# EAGLE design LED tail lights (EAGLE 4.13)
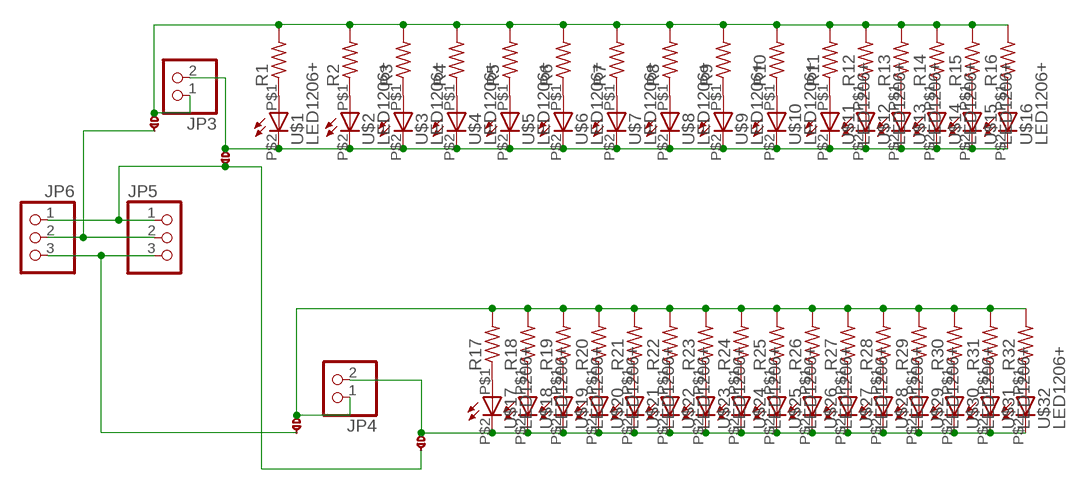
[diagram p0: schematic, sheet 1]

## Parts
JP3  PINHD-1X2  [1X02]
JP4  PINHD-1X2  [1X02]
JP5  PINHD-1X3  [1X03]
JP6  PINHD-1X3  [1X03]
R1  RESISITORR1206  [R1206]
R2  RESISITORR1206  [R1206]
R3  RESISITORR1206  [R1206]
R4  RESISITORR1206  [R1206]
R5  RESISITORR1206  [R1206]
R6  RESISITORR1206  [R1206]
R7  RESISITORR1206  [R1206]
R8  RESISITORR1206  [R1206]
R9  RESISITORR1206  [R1206]
R10  RESISITORR1206  [R1206]
R11  RESISITORR1206  [R1206]
R12  RESISITORR1206  [R1206]
R13  RESISITORR1206  [R1206]
R14  RESISITORR1206  [R1206]
R15  RESISITORR1206  [R1206]
R16  RESISITORR1206  [R1206]
R17  RESISITORR1206  [R1206]
R18  RESISITORR1206  [R1206]
R19  RESISITORR1206  [R1206]
R20  RESISITORR1206  [R1206]
R21  RESISITORR1206  [R1206]
R22  RESISITORR1206  [R1206]
R23  RESISITORR1206  [R1206]
R24  RESISITORR1206  [R1206]
R25  RESISITORR1206  [R1206]
R26  RESISITORR1206  [R1206]
R27  RESISITORR1206  [R1206]
R28  RESISITORR1206  [R1206]
R29  RESISITORR1206  [R1206]
R30  RESISITORR1206  [R1206]
R31  RESISITORR1206  [R1206]
R32  RESISITORR1206  [R1206]
U$1  LED1206+  [1206+]
U$2  LED1206+  [1206+]
U$3  LED1206+  [1206+]
U$4  LED1206+  [1206+]
U$5  LED1206+  [1206+]
U$6  LED1206+  [1206+]
U$7  LED1206+  [1206+]
U$8  LED1206+  [1206+]
U$9  LED1206+  [1206+]
U$10  LED1206+  [1206+]
U$11  LED1206+  [1206+]
U$12  LED1206+  [1206+]
U$13  LED1206+  [1206+]
U$14  LED1206+  [1206+]
U$15  LED1206+  [1206+]
U$16  LED1206+  [1206+]
U$17  LED1206+  [1206+]
U$18  LED1206+  [1206+]
U$19  LED1206+  [1206+]
U$20  LED1206+  [1206+]
U$21  LED1206+  [1206+]
U$22  LED1206+  [1206+]
U$23  LED1206+  [1206+]
U$24  LED1206+  [1206+]
U$25  LED1206+  [1206+]
U$26  LED1206+  [1206+]
U$27  LED1206+  [1206+]
U$28  LED1206+  [1206+]
U$29  LED1206+  [1206+]
U$30  LED1206+  [1206+]
U$31  LED1206+  [1206+]
U$32  LED1206+  [1206+]
U$34  SPLIT_PAD  [SPLIT_PAD]
U$35  SPLIT_PAD  [SPLIT_PAD]
U$36  SPLIT_PAD  [SPLIT_PAD]
U$37  SPLIT_PAD  [SPLIT_PAD]

## Nets
N$1: R1.1 U$1.P$1(+)
N$2: R2.1 U$2.P$1(+)
N$3: R3.1 U$3.P$1(+)
N$4: R4.1 U$4.P$1(+)
N$5: R5.1 U$5.P$1(+)
N$6: R6.1 U$6.P$1(+)
N$7: R7.1 U$7.P$1(+)
N$8: R8.1 U$8.P$1(+)
N$9: R9.1 U$9.P$1(+)
N$10: R10.1 U$10.P$1(+)
N$13: R11.1 U$11.P$1(+)
N$16: R12.1 U$12.P$1(+)
N$17: R13.1 U$13.P$1(+)
N$18: R14.1 U$14.P$1(+)
N$19: R15.1 U$15.P$1(+)
N$20: R16.1 U$16.P$1(+)
N$21: R32.1 U$32.P$1(+)
N$22: R31.1 U$31.P$1(+)
N$23: R30.1 U$30.P$1(+)
N$24: R29.1 U$29.P$1(+)
N$25: R28.1 U$28.P$1(+)
N$26: R27.1 U$27.P$1(+)
N$27: R26.1 U$26.P$1(+)
N$28: R25.1 U$25.P$1(+)
N$29: R24.1 U$24.P$1(+)
N$30: R23.1 U$23.P$1(+)
N$31: R22.1 U$22.P$1(+)
N$32: R21.1 U$21.P$1(+)
N$33: R20.1 U$20.P$1(+)
N$34: R19.1 U$19.P$1(+)
N$35: R18.1 U$18.P$1(+)
N$36: R17.1 U$17.P$1(+)
N$38: JP4.1 R17.2 R18.2 R19.2 R20.2 R21.2 R22.2 R23.2 R24.2 R25.2 R26.2 R27.2 R28.2 R29.2 R30.2 R31.2 R32.2 U$37.P$1
N$39: JP3.1 R1.2 R2.2 R3.2 R4.2 R5.2 R6.2 R7.2 R8.2 R9.2 R10.2 R11.2 R12.2 R13.2 R14.2 R15.2 R16.2 U$34.P$1
N$43: JP4.2 U$17.P$2(-) U$18.P$2(-) U$19.P$2(-) U$20.P$2(-) U$21.P$2(-) U$22.P$2(-) U$23.P$2(-) U$24.P$2(-) U$25.P$2(-) U$26.P$2(-) U$27.P$2(-) U$28.P$2(-) U$29.P$2(-) U$30.P$2(-) U$31.P$2(-) U$32.P$2(-) U$36.P$1
N$45: JP5.1 JP6.1 U$35.P$2 U$36.P$2
N$46: JP5.2 JP6.2 U$34.P$2
N$47: JP5.3 JP6.3 U$37.P$2
N$48: JP3.2 U$1.P$2(-) U$2.P$2(-) U$3.P$2(-) U$4.P$2(-) U$5.P$2(-) U$6.P$2(-) U$7.P$2(-) U$8.P$2(-) U$9.P$2(-) U$10.P$2(-) U$11.P$2(-) U$12.P$2(-) U$13.P$2(-) U$14.P$2(-) U$15.P$2(-) U$16.P$2(-) U$35.P$1

## Library data of the parts
JP3 JP4 = pinhead:PINHD-1X2: PIN HEADER
JP5 JP6 = pinhead:PINHD-1X3: PIN HEADER
R1-R32 = 1 Dan's Common Parts:RESISITOR: RESISTOR, American symbol
U$1-U$32 = 1 Dan's Common Parts:LED
U$34-U$37 = 1 Dan's Common Parts:SPLIT_PAD

## Board
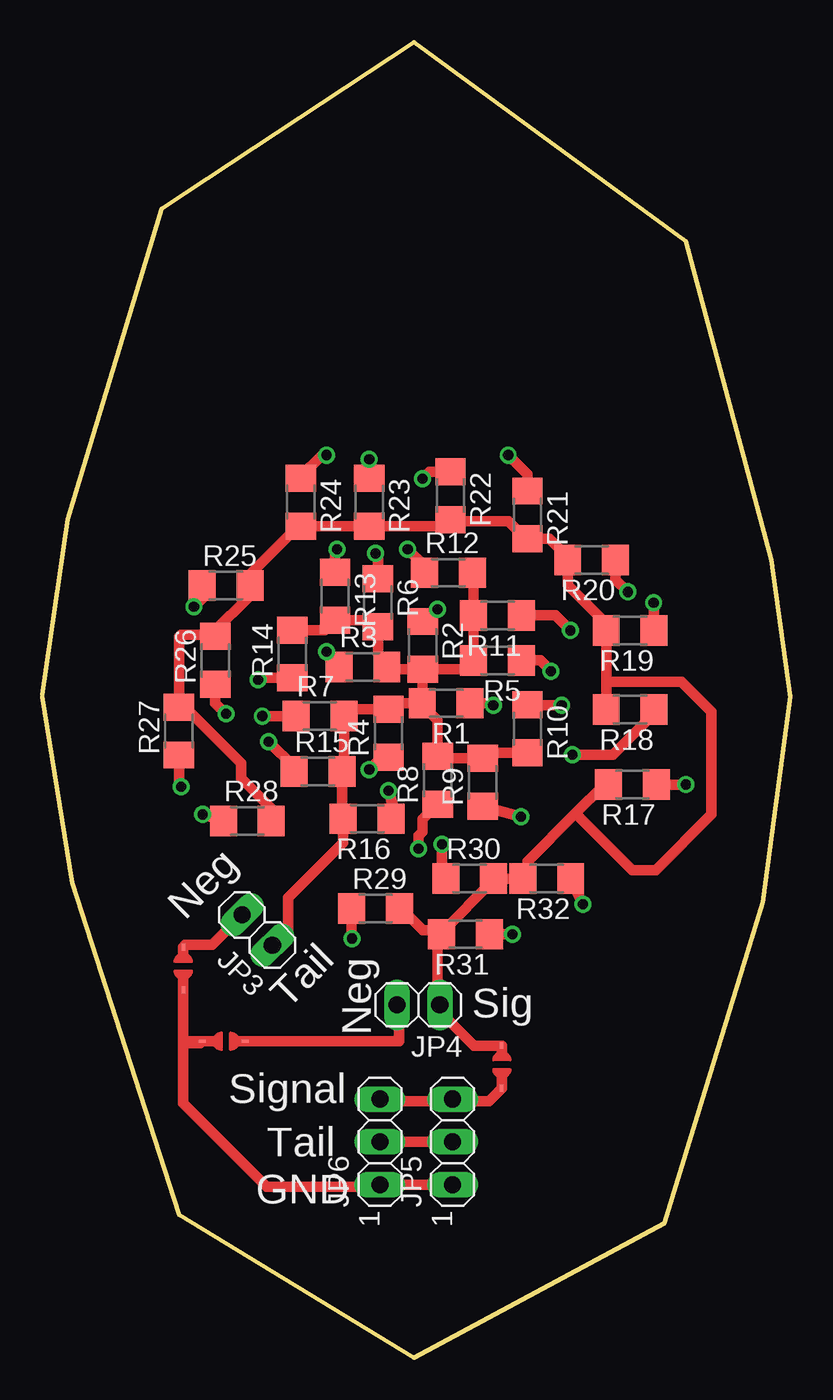
[diagram p1: board, top side]
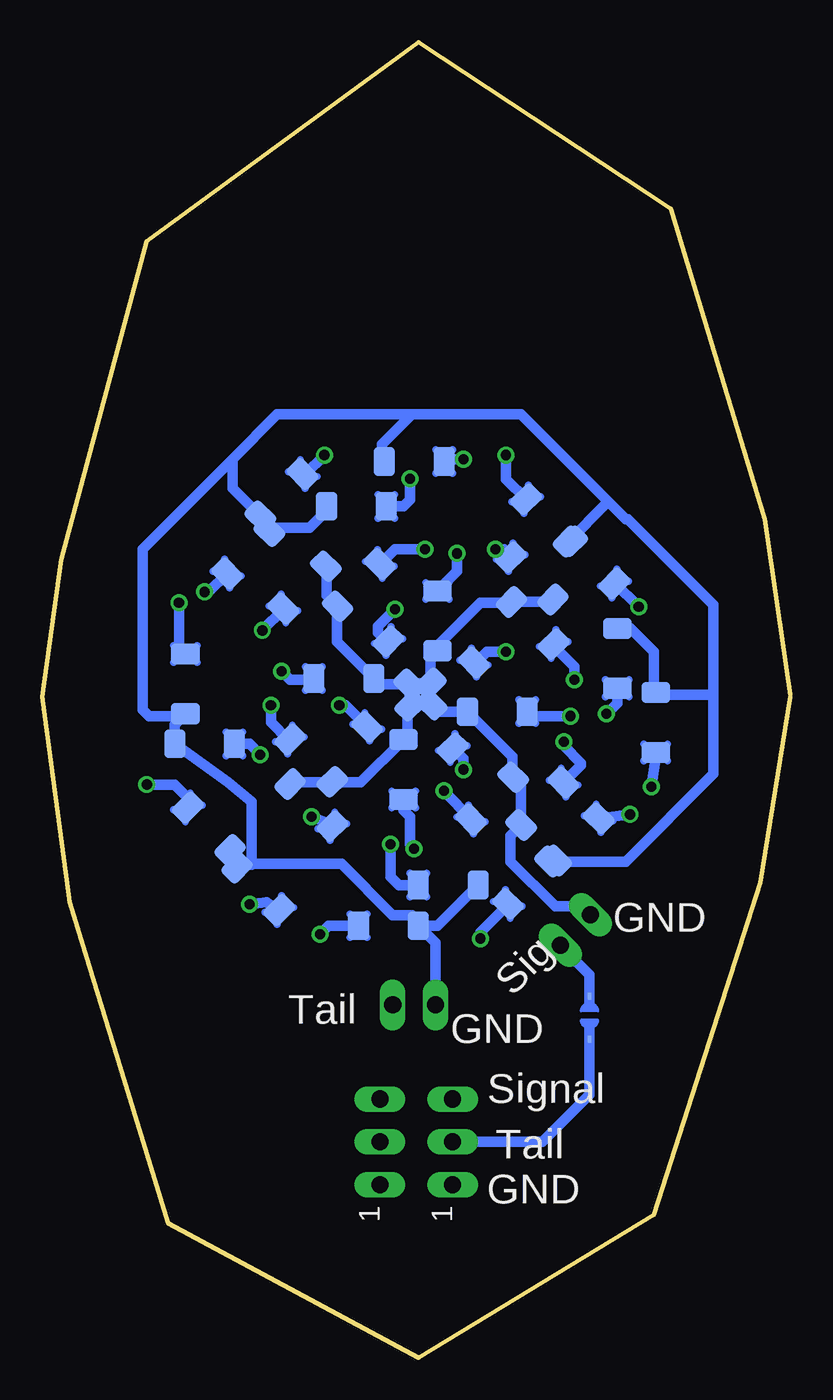
[diagram p2: board, bottom side, seen from below]

Size 44.45 x 78.1 mm. Coordinates in mm from the lower left corner, seen from the top.
Outline: 0,39.37 1.52,49.78 7.11,68.2 22.1,78.1 38.23,66.29 43.31,47.37 44.45,39.24 42.8,27.05 36.96,8 22.1,0 8.13,8.51 1.78,28.19 0,39.24
Copper layers (1*16): Top 0.035mm / dielectric 1.5mm / Bottom 0.035mm
Design rules "default": minimum track width 10mil, minimum drill 20mil, track to track 8mil, track to pad 8mil, pad to pad 8mil, via to via 8mil, smd to smd 0mil, copper to edge 40mil, drill to drill 8mil, minimum pad ring 10mil, minimum via ring 8mil, stop-mask expansion 4mil, vias tented up to drill 0mil, thermal gap 10mil

### Footprints (pad centres in the part's own frame; a part is rotated, then mirrored left to right if it is on the bottom)
1X02 = drill 1.016 long: 1 -1.27,0; 2 1.27,0
1X03 = drill 1.016 long: 1 -2.54,0; 2 0,0; 3 2.54,0
R1206 = smd 1.6 x 1.803: 1 -1.422,0; 2 1.422,0
1206+ = smd 1.25 x 1.7: P$1 0,0; P$2 3.55,0
SPLIT_PAD = smd 0.406 x 0.203: P$1 0,0; P$2 2.54,0

### Placement (x,y rotation side)
JP3  12.77,25.4 135 top
JP4  22.35,20.96 180 top
JP5  24.38,12.83 90 top
JP6  20.07,12.83 90 top
R1  24,38.86 180 top
R2  22.61,42.29 270 top
R3  19.05,41.02 0 top
R4  20.57,37.08 90 top
R5  27.05,41.4 180 top
R6  19.94,44.83 270 top
R7  16.51,38.1 0 top
R8  23.5,34.29 90 top
R9  26.16,34.16 90 top
R10  28.83,37.34 270 top
R11  27.05,44.07 180 top
R12  24.13,46.61 0 top
R13  17.4,45.21 270 top
R14  14.86,41.78 90 top
R15  16.38,34.8 0 top
R16  19.3,32 180 top
R17  35.05,34.04 180 top
R18  34.92,38.48 180 top
R19  34.92,43.18 180 top
R20  32.64,47.37 180 top
R21  28.83,50.04 270 top
R22  24.26,51.18 270 top
R23  19.43,50.8 270 top
R24  15.37,50.8 270 top
R25  10.92,45.85 0 top
R26  10.29,41.4 90 top
R27  8.13,37.21 90 top
R28  12.19,31.88 0 top
R29  19.81,26.67 0 top
R30  25.4,28.45 0 top
R31  25.15,25.15 180 top
R32  29.97,28.45 180 top
U$1  25.15,37.47 45 bottom
U$2  23.88,42.55 315 bottom
U$3  18.8,41.27 225 bottom
U$4  20.07,36.2 135 bottom
U$5  28.3,40.33 0 bottom
U$6  20.96,45.53 270 bottom
U$7  15.63,38.36 180 bottom
U$8  22.98,33.16 90 bottom
U$9  27.21,31.56 135 bottom
U$10  29.73,36.71 315 bottom
U$11  30.11,44.49 45 bottom
U$12  24.39,47.13 225 bottom
U$13  16.62,47.53 315 bottom
U$14  14.07,42.37 135 bottom
U$15  13.48,34.15 225 bottom
U$16  18.98,31.96 45 bottom
U$17  35.79,32.67 315 bottom
U$18  33.02,36.45 180 bottom
U$19  35.94,41.78 270 bottom
U$20  33.46,46.56 45 bottom
U$21  28.98,52.47 225 bottom
U$22  24,50.55 180 bottom
U$23  20.57,53.21 180 bottom
U$24  15.7,50.97 315 bottom
U$25  10.46,45.96 135 bottom
U$26  10.29,39.75 90 bottom
U$27  8,35.94 90 bottom
U$28  11.4,32.03 225 bottom
U$29  16.79,26.95 45 bottom
U$30  22.1,28.07 0 bottom
U$31  25.65,25.65 0 bottom
U$32  30.36,26.59 135 bottom
U$34  11.94,21.46 270 bottom
U$35  8.38,24.38 270 top
U$36  12.06,18.8 180 top
U$37  27.3,18.54 270 top

### Tracks (layer width: path | path; a pad name or v marks a point on that pad's centre or on a via)
N$1  (via drill 0.6)
  Top 0.61: 25.4,38.86 R1.1 26.67,38.86 v26.8,38.73
  Bottom 0.61: U$1.P$1 26.42,38.73 v26.8,38.73
N$2  (via drill 0.6)
  Top 0.61: R2.1 22.76,43.71 v23.5,44.45
  Bottom 0.61: v23.5,44.45 24.51,43.43 24.51,43.05 23.88,42.42 U$2.P$1
N$3  (via drill 0.6)
  Top 0.61: R3.1 17.63,41.17 v16.89,41.91
  Bottom 0.61: U$3.P$1 18.8,41.15 18.03,41.91 v16.89,41.91
N$4  (via drill 0.6)
  Top 0.61: R4.1 20.47,35.56 20.07,35.56 v19.43,34.93
  Bottom 0.61: U$4.P$1 19.43,35.56 v19.43,34.93
N$5  (via drill 0.6)
  Top 0.61: R5.1 29.59,41.4 v30.23,40.77
  Bottom 0.61: U$5.P$1 28.38,40.26 29.72,40.26 v30.23,40.77
N$6  (via drill 0.6)
  Top 0.61: 19.94,46.23 R6.1 19.94,47.62 v19.81,47.75
  Bottom 0.61: U$6.P$1 19.81,46.68 v19.81,47.75
N$7  (via drill 0.6)
  Top 0.61: v13.08,38.1 R7.1
  Bottom 0.61: U$7.P$1 15.74,38.36 15.75,38.35 15.49,38.1 v13.08,38.1
N$8  (via drill 0.6)
  Top 0.61: R8.1 22.61,31.98 22.61,31.24 22.35,30.99 v22.35,30.23
  Bottom 0.61: v22.35,30.23 22.61,30.48 22.61,32.13 22.99,32.51 U$8.P$1 | U$8.P$1 | U$8.P$1
N$9  (via drill 0.6)
  Top 0.61: R9.1 v28.45,32.13
  Bottom 0.61: U$9.P$1 27.18,31.62 v28.45,32.13
N$10  (via drill 0.6)
  Top 0.61: R10.1 28.85,38.73 v30.86,38.73
  Bottom 0.61: U$10.P$1 29.84,36.71 29.84,36.7 30.86,37.72 v30.86,38.73
N$13  (via drill 0.6)
  Top 0.61: R11.1 30.48,44.07 v31.37,43.18
  Bottom 0.61: U$11.P$1 30.11,44.47 30.1,44.45 v31.37,43.18
N$16  (via drill 0.6)
  Top 0.61: R12.1 22.71,47.02 v21.72,48.01
  Bottom 0.61: 24.39,47.11 24.51,46.99 | 24.39,47.11 U$12.P$1 | v21.72,48.01 23.5,48.01 24.39,47.11
N$17  (via drill 0.6)
  Top 0.61: R13.1 17.4,47.88 v17.53,48.01
  Bottom 0.61: 16.54,47.53 16.51,47.5 | U$13.P$1 16.54,47.53 | v17.53,48.01 17.02,48.01 16.54,47.53
N$18  (via drill 0.6)
  Top 0.61: R14.1 12.93,40.36 v12.83,40.26
  Bottom 0.61: U$14.P$1 14.07,42.32 14.1,42.29 12.83,41.02 v12.83,40.26
N$19  (via drill 0.6)
  Top 0.61: R15.1 14.96,35.08 v13.46,36.58
  Bottom 0.61: v13.46,36.58 13.46,36.32 12.45,35.31 12.45,35.18 13.48,34.15 U$15.P$1
N$20  (via drill 0.6)
  Top 0.61: R16.1 21.08,32 v20.57,33.66
  Bottom 0.61: U$16.P$1 v20.57,33.66
N$21  (via drill 0.6)
  Top 0.61: v32.13,26.92 R32.1
  Bottom 0.61: v32.13,26.92 31.12,27.05 30.23,26.42 U$32.P$1
N$22  (via drill 0.6)
  Top 0.61: R31.1 v27.94,25.15
  Bottom 0.61: 25.53,25.65 U$31.P$1 27.43,25.65 v27.94,25.15
N$23  (via drill 0.6)
  Top 0.61: R30.1 23.88,28.45 23.75,28.58 v23.75,30.48
  Bottom 0.61: U$30.P$1 23.24,28.07 23.75,28.58 v23.75,30.48
N$24  (via drill 0.6)
  Top 0.61: R29.1 18.39,24.92 v18.41,24.89
  Bottom 0.61: U$29.P$1 16.76,26.92 18.41,25.27 v18.41,24.89
N$25  (via drill 0.6)
  Top 0.61: R28.1 v9.53,32.26
  Bottom 0.61: U$28.P$1 11.43,32 v9.53,32.26
N$26  (via drill 0.6)
  Top 0.61: R27.1 8.13,34.04 v8.26,33.91
  Bottom 0.61: U$27.P$1 8,35.69 v8.26,33.91
N$27  (via drill 0.6)
  Top 0.61: v10.92,38.23 10.29,38.86 10.29,39.88 10.19,39.98 | 10.19,39.98 10.16,40.01 | 10.19,39.98 R26.1
  Bottom 0.61: U$26.P$1 10.29,38.86 v10.92,38.23
N$28  (via drill 0.6)
  Top 0.61: R25.1 9.5,45.06 v9.02,44.58
  Bottom 0.61: U$25.P$1 10.42,45.97 10.41,45.97 v9.02,44.58
N$29  (via drill 0.6)
  Top 0.61: R24.1 15.37,52.32 16.64,53.59 v16.89,53.59
  Bottom 0.61: U$24.P$1 16.89,52.17 v16.89,53.59
N$30  (via drill 0.6)
  Top 0.61: R23.1 v19.43,53.34
  Bottom 0.61: U$23.P$1 20.57,53.34 v19.43,53.34
N$31  (via drill 0.6)
  Top 0.61: R22.1 23.01,52.6 v22.61,52.2
  Bottom 0.61: v22.61,52.2 22.61,50.93 22.99,50.55 U$22.P$1 24.13,50.67
N$32  (via drill 0.6)
  Top 0.61: R21.1 28.83,52.45 v27.69,53.59
  Bottom 0.61: U$21.P$1 28.84,52.47 28.83,52.45 v27.69,53.59
N$33  (via drill 0.6)
  Top 0.61: R20.1 34.06,46.2 v34.8,45.47
  Bottom 0.61: U$20.P$1 34.54,45.47 v34.8,45.47
N$34  (via drill 0.6)
  Top 0.61: R19.1 36.35,44.81 v36.32,44.83
  Bottom 0.61: U$19.P$1 35.94,41.66 36.32,42.04 v36.32,44.83
N$35  (via drill 0.6)
  Top 0.61: R18.1 36.35,38.46 36.45,38.35 33.91,35.81 v31.5,35.81
  Bottom 0.61: U$18.P$1 32.13,36.45 v31.5,35.81
N$36  (via drill 0.6)
  Top 0.61: 36.45,34.04 R17.1 v38.23,34.04
  Bottom 0.61: U$17.P$1 35.41,32.87 36.58,34.04 v38.23,34.04
N$38
  Top 0.61: 23.5,25.38 23.5,25.4 | 23.5,25.38 R31.2 23.72,25.25 26.82,28.35 R30.2 | 23.5,25.38 23.5,21.08 JP4.1 23.62,20.83 23.5,20.7 25.65,18.54 U$37.P$1 | R17.2 33.4,34.04 31.69,32.32 | 31.69,32.32 28.83,29.46 28.83,28.45 R32.2 R30.2 | R30.2 26.67,28.45 | R29.2 21.34,26.67 22.63,25.38 23.5,25.38 | R28.2 13.61,32.61 11.81,34.42 11.81,35.31 8.26,38.86 8.13,38.73 R27.2 8.13,42.8 8.26,42.93 10.54,42.93 10.44,42.82 R26.2 10.29,43.18 12.19,45.09 12.19,45.85 12.34,46 | 12.34,46 12.57,46.23 | 12.34,46 R25.2 12.34,46.51 15.24,49.4 15.27,49.38 R24.2 R23.2 | R23.2 19.46,49.38 19.56,49.28 | R23.2 24.11,49.38 24.38,49.66 24.28,49.76 R22.2 24.79,49.76 24.89,49.66 27.69,49.66 28.83,48.51 R21.2 30.12,48.62 31.37,47.37 R20.2 31.22,45.87 33.66,43.43 33.5,43.28 R19.2 33.53,43.18 33.5,43.16 R18.2 33.5,40.11 33.53,40.13 37.97,40.13 39.75,38.35 39.75,32.26 36.45,28.96 36.07,28.96 | 36.07,28.96 35.05,28.96 31.69,32.32 | 36.07,28.96 36.2,28.96
N$39
  Top 0.61: 13.67,24.47 13.59,24.38 | JP3.1 13.67,24.47 | 13.67,24.47 14.61,25.4 14.61,27.31 17.88,30.58 R16.2 17.91,32 17.8,32.11 R15.2 17.8,34.65 17.91,34.54 17.93,34.57 R7.2 18.03,38.1 18.44,38.51 R4.2 20.68,38.51 20.7,38.48 21.08,38.86 R1.2 | 26.06,35.59 26.04,35.56 | 26.06,35.59 R9.2 23.6,35.59 23.47,35.71 | R10.2 26.39,35.92 26.06,35.59 | 23.47,35.71 23.37,35.81 | 23.47,35.71 R8.2 23.5,37.85 22.58,38.76 R1.2 | R2.2 22.61,40.89 22.58,40.87 R1.2 | R2.2 25.12,40.87 25.65,41.4 R5.2 25.63,41.17 | R2.2 20.73,40.87 20.57,41.02 R3.2 20.7,41.02 19.94,41.78 R6.2 19.96,43.41 | 25.63,41.17 R11.2 25.63,46.76 25.55,46.84 | 25.63,41.17 25.65,41.15 | 25.55,46.84 25.53,46.86 | 25.55,46.84 R12.2 | R14.2 16.79,43.2 17.4,43.82 R13.2 19.58,43.79 19.96,43.41 | 19.96,43.41 20.07,43.31
  Bottom 0.61: JP3.1 13.67,24.47 11.94,22.73 U$34.P$1
N$43
  Top 0.61: 21.21,21.08 21.21,21.21 | 21.21,21.08 JP4.2 | U$36.P$1 21.21,18.8 21.21,21.08
  Bottom 0.61: 4.57,39.37 4.57,34.67 9.78,29.46 U$29.P$2 13.84,29.46 13.78,29.53 | 4.57,39.37 4.57,39.5 4.7,39.37 8.12,39.37 | 8.12,39.37 8.13,39.37 | U$27.P$2 8.12,39.37 | U$27.P$2 7.88,39.37 4.57,39.37 | 4.57,39.37 4.57,44.7 9.65,49.78 9.78,49.78 10.86,50.86 | 10.86,50.86 16,56.01 22.48,56.01 | 24.26,53.08 24.26,52.83 | 24.26,53.08 U$23.P$2 | 22.48,56.01 24.26,54.23 24.26,53.08 | 10.86,50.86 10.92,50.8 10.92,50.72 U$24.P$2 13,48.64 12.95,48.64 12.95,48.49 U$25.P$2 | 33.15,53.34 33.15,51.62 U$21.P$2 31.75,50.22 | 33.15,53.34 30.48,56.01 22.48,56.01 | U$22.P$2 27.56,50.29 28.58,49.28 30.74,49.28 U$20.P$2 31.75,49.86 31.75,50.22 | 31.75,50.22 31.75,50.29 | U$31.P$2 22.23,25.65 | U$30.P$2 20.96,25.65 21.84,25.65 | U$31.P$2 21.08,24.63 JP4.2 21.21,20.83 | 32.64,29.46 32.64,29.52 U$17.P$2 32.51,29.28 | 32.51,29.28 32.51,29.34 | 32.64,29.33 U$32.P$2 | 32.51,29.28 32.64,29.46 | 32.51,29.28 32,29.28 32,33.02 33.4,34.16 U$18.P$2 36.57,37.6 U$19.P$2 | 33.15,53.34 38.48,48.01 38.48,38.48 38.1,38.1 35.81,38.1 35.81,38.11 U$19.P$2 | 13.78,29.53 13.72,29.59 | 13.78,29.53 U$28.P$2 | U$19.P$2 35.81,38.35 | U$26.P$2 9.52,43.3 8.13,41.91 8.13,39.88 8,39.75 U$27.P$2 | 32.64,29.33 32.64,28.96 32.51,29.34 | 32.64,29.33 32.64,29.46 | 32.51,29.34 26.67,29.34 23.62,26.29 22.48,26.29 21.84,25.65 | U$31.P$2 21.84,25.65
N$45
  Top 0.61: JP5.1 JP6.1 20.07,10.16 13.34,10.16 8.38,15.11 8.38,18.67 | 8.38,18.67 U$35.P$2 | 8.38,18.67 9.4,18.67 U$36.P$2 8.51,18.8 8.38,18.67
N$46
  Top 0.61: 24.64,12.83 JP5.2 JP6.2
  Bottom 0.61: JP5.2 24,12.83 | U$34.P$2 11.94,15.62 14.73,12.83 20.19,12.83 | 20.19,12.83 JP6.2 | 20.19,12.83 20.32,12.95
N$47
  Top 0.61: JP6.3 20.07,15.24 24.26,15.24 JP5.3 24.38,15.24 26.54,15.24 U$37.P$2
N$48
  Top 0.61: U$35.P$1 8.51,24.51 10.09,24.51 JP3.2
  Bottom 0.61: 20.89,41.98 20.83,42.04 | 20.89,41.98 U$6.P$2 20.96,42.28 18.41,44.83 16.38,44.83 16.43,44.88 U$14.P$2 14.18,44.88 14.04,45.02 | U$2.P$2 21.37,41.5 20.89,41.98 | 14.04,45.02 13.97,45.09 | 14.04,45.02 U$13.P$2 | 21.24,38.77 21.21,38.73 | 21.24,38.77 U$3.P$2 20.9,38.35 U$7.P$2 | U$2.P$2 21.37,38.89 21.24,38.77 | U$1.P$2 22.64,39.91 22.61,39.88 22.45,40.04 U$2.P$2 | U$1.P$2 22.64,38.77 U$4.P$2 22.73,38.55 22.73,36.83 22.85,36.83 U$8.P$2 25.52,34.16 27.26,34.16 | 24.84,40.33 24.89,40.39 | 24.84,40.33 U$5.P$2 26.92,42.5 26.92,44.6 U$12.P$2 27.56,45.28 27.56,46.99 U$11.P$2 | U$1.P$2 24.48,39.98 24.84,40.33 | 27.26,34.16 27.43,34.16 | 29.81,34.16 29.84,34.16 | 29.81,34.16 U$9.P$2 | 27.26,34.16 U$10.P$2 | 27.26,34.16 29.81,34.16 | U$7.P$2 19.05,38.35 | U$7.P$2 16.51,35.69 16.51,34.43 | 16.51,34.43 16.51,34.29 | 16.51,34.43 U$16.P$2 16,34.01 16,31.63 | 16,31.63 16,31.62 | 16,31.63 U$15.P$2 | 16,31.63 16.64,30.99 16.64,29.46 13.97,26.8 12.7,26.8 12.19,26.29 11.88,26.29 JP3.2

### Text on the board
tNames: Neg | Neg | Tail | Sig | Signal | Tail | GND
bNames: GND | Sig | Tail | GND | Signal | Tail | GND